# EAGLE design dengenn_top (EAGLE 9.6.2)
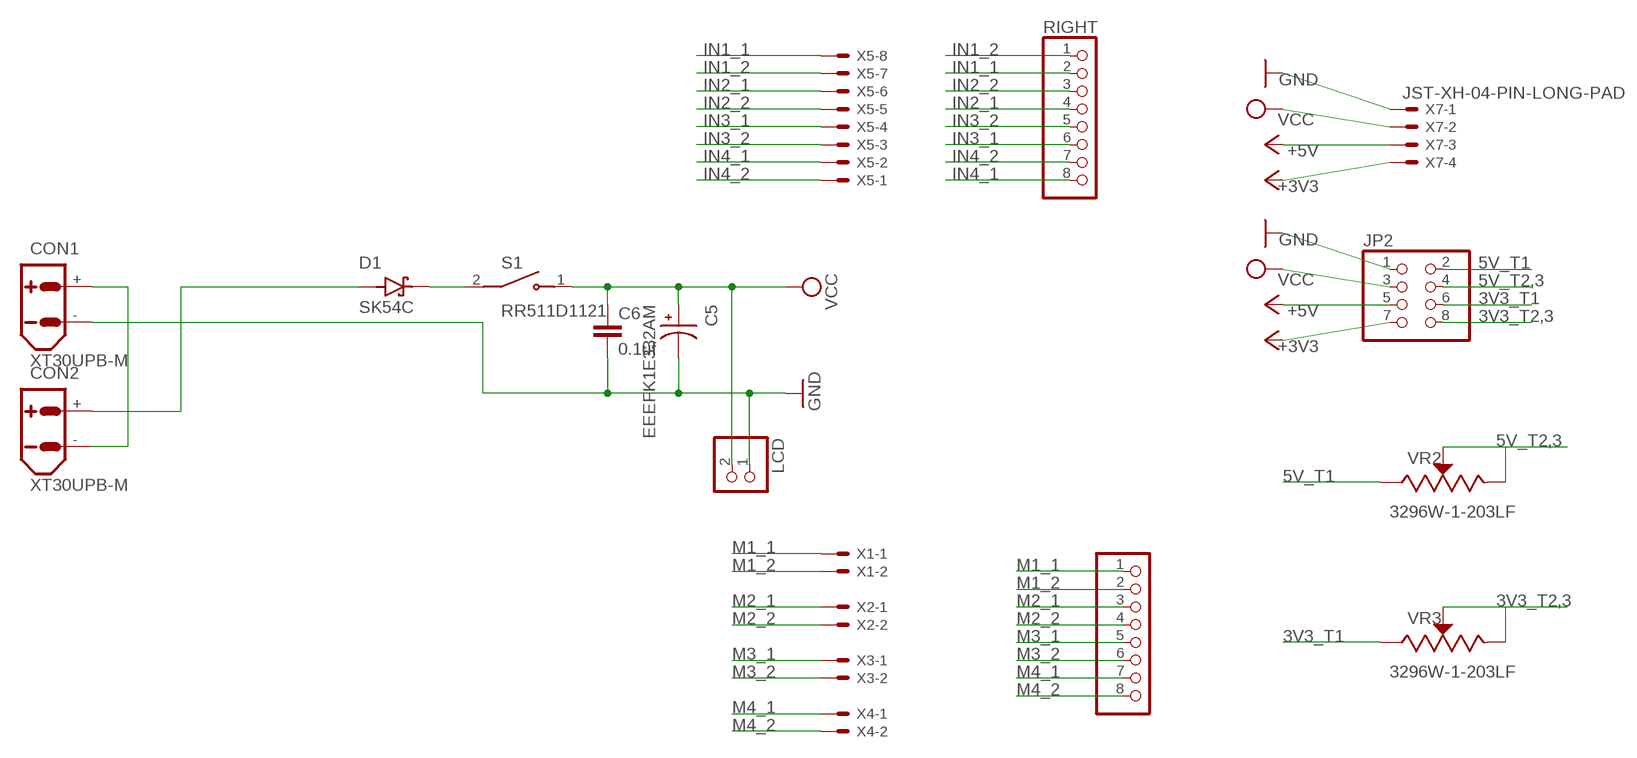
[diagram p0: schematic, sheet 1]

## Parts
C5  EEEFK1E332AM  [CAP_EEEFK1E332AM]
C6  0.1uf  C-EUC0603  [C0603]
CON1  XT30UPB-M  [XT30UPB-M]
CON2  XT30UPB-M  [XT30UPB-M]
D1  SK54C  [DIOM6859X262N]
JP2  PINHD-2X4  [2X04]
LCD  PINHD-1X2  [1X02]
LEFT  PINHD-1X8  [1X08]
RIGHT  PINHD-1X8  [1X08]
S1  RR511D1121  [E-SWITCH_RR511D1121]
VR2  3296W-1-203LF  [TRIM_3296W-1-203LF]
VR3  3296W-1-203LF  [TRIM_3296W-1-203LF]
X1  JST-XH-02-PIN-LONG-PAD  [JST-XH-02-PACKAGE-LONG-PAD]
X2  JST-XH-02-PIN-LONG-PAD  [JST-XH-02-PACKAGE-LONG-PAD]
X3  JST-XH-02-PIN-LONG-PAD  [JST-XH-02-PACKAGE-LONG-PAD]
X4  JST-XH-02-PIN-LONG-PAD  [JST-XH-02-PACKAGE-LONG-PAD]
X5  JST-XH-08-PIN-ROUND-PAD  [JST-XH-08-PACKAGE-ROUND-PAD]
X7  JST-XH-04-PIN-LONG-PAD  [JST-XH-04-PACKAGE-LONG-PAD]

## Nets
3V3_T1: JP2.6 VR3.1(CCW)
3V3_T2,3: JP2.8 VR3.2(WIPER) VR3.3(CW)
5V_T1: JP2.2 VR2.1(CCW)
5V_T2,3: JP2.4 VR2.2(WIPER) VR2.3(CW)
+3V3: JP2.7 X7.4
+5V: JP2.5 X7.3
GND: C5.2 C6.2 CON1.- JP2.1 LCD.1 X7.1
IN1_1: RIGHT.2 X5.8
IN1_2: RIGHT.1 X5.7
IN2_1: RIGHT.4 X5.6
IN2_2: RIGHT.3 X5.5
IN3_1: RIGHT.6 X5.4
IN3_2: RIGHT.5 X5.3
IN4_1: RIGHT.8 X5.2
IN4_2: RIGHT.7 X5.1
M1_1: LEFT.1 X1.1
M1_2: LEFT.2 X1.2
M2_1: LEFT.3 X2.1
M2_2: LEFT.4 X2.2
M3_1: LEFT.5 X3.1
M3_2: LEFT.6 X3.2
M4_1: LEFT.7 X4.1
M4_2: LEFT.8 X4.2
N$1: CON1.+ CON2.-
N$2: CON2.+ D1.A
N$12: D1.C(K) S1.2(COM)
VCC: C5.1 C6.1 JP2.3 LCD.2 S1.1(NO) X7.2

## Library data of the parts
C5 = EEEFK1E332AM:EEEFK1E332AM: Check availability <https://pricing.snapeda.com/parts/EEEFK1E332AM/Panasonic/view-part?ref=eda>; AVAILABILITY: In Stock; DESCRIPTION: 3300µF 25V Aluminum Electrolytic Capacitors Radial, Can - SMD 5000 Hrs @ 105°C; MF: Panasonic; MP: EEEFK1E332AM; PACKAGE: RADIAL-2 Panasonic; PRICE: None; PURCHASE-URL: https://pricing.snapeda.com/search/part/EEEFK1E332AM/?ref=eda
C6 = rcl:C-EU: CAPACITOR, European symbol; SPICEPREFIX: C
CON1 CON2 = amass:XT30: AMASS XT30 connector Store in Japan AMASS XT30 connector <https://szc.jp/ams-xt30>
D1 = SK54C:SK54C: Check availability <https://pricing.snapeda.com/parts/SK54C/Taiwan%20Semiconductor/view-part?ref=eda>; AVAILABILITY: In Stock; DESCRIPTION: 5A, 40V, Schottky Rectifier; MF: Taiwan Semiconductor; MP: SK54C; PACKAGE: SMC-2 Taiwan Semiconductor; PRICE: None; PURCHASE-URL: https://pricing.snapeda.com/search/part/SK54C/?ref=eda
JP2 = pinhead:PINHD-2X4: PIN HEADER
LCD = pinhead:PINHD-1X2: PIN HEADER
LEFT RIGHT = pinhead:PINHD-1X8: PIN HEADER
S1 = RR511D1121:RR511D1121: Check availability <https://pricing.snapeda.com/parts/RR511D1121/E-Switch/view-part?ref=eda>; AVAILABILITY: In Stock; DESCRIPTION: Rocker Switch, RR5 Series, SPST,OFF-ON,Blk Rocker,I/O Legend, 20A, 125VAC, QC; MF: E-Switch; MP: RR511D1121; PACKAGE: None; PRICE: None; PURCHASE-URL: https://pricing.snapeda.com/search/part/RR511D1121/?ref=eda
VR2 VR3 = 3296W-1-203LF:3296W-1-203LF: Res Cermet Trimmer 500K Ohm 10% 0.5W 25(Elec)Turn 2.19mm (9.53 X 4.83 X 11.55mm) Pin Thru-Hole Tube Check availability <https://pricing.snapeda.com/parts/3296W-1-203LF/Bourns/view-part?ref=eda>; AVAILABILITY: In Stock; DESCRIPTION: 20 kOhms 0.5W, 1/2W PC Pins Through Hole Trimmer Potentiometer Cermet 25.0 Turn Top Adjustment; MF: Bourns; MP: 3296W-1-203LF; PACKAGE: NON STANDARD-3 Bourns; PRICE: None; PURCHASE-URL: https://pricing.snapeda.com/search/part/3296W-1-203LF/?ref=eda
X1-X4 = JST XH Connectors v1-0:JST-XH-02-PIN: JST XH Connector 2 Pin Wire to board connector. Pitch: 2,54 mm, (0.100") Number of pins: 2 Created by Rembrandt Electronics www.rembrandtelectronics.com
X5 = Rembrandt Electronics - JST XH Connectors v1-0:JST-XH-08-PIN: JST XH Connector 2 Pin Wire to board connector. Pitch: 2,54 mm, (0.100") Number of pins: 8 Created by Rembrandt Electronics www.rembrandtelectronics.com
X7 = JST XH Connectors v1-0:JST-XH-04-PIN: JST XH Connector 2 Pin Wire to board connector. Pitch: 2,54 mm, (0.100") Number of pins: 4 Created by Rembrandt Electronics www.rembrandtelectronics.com

## Board
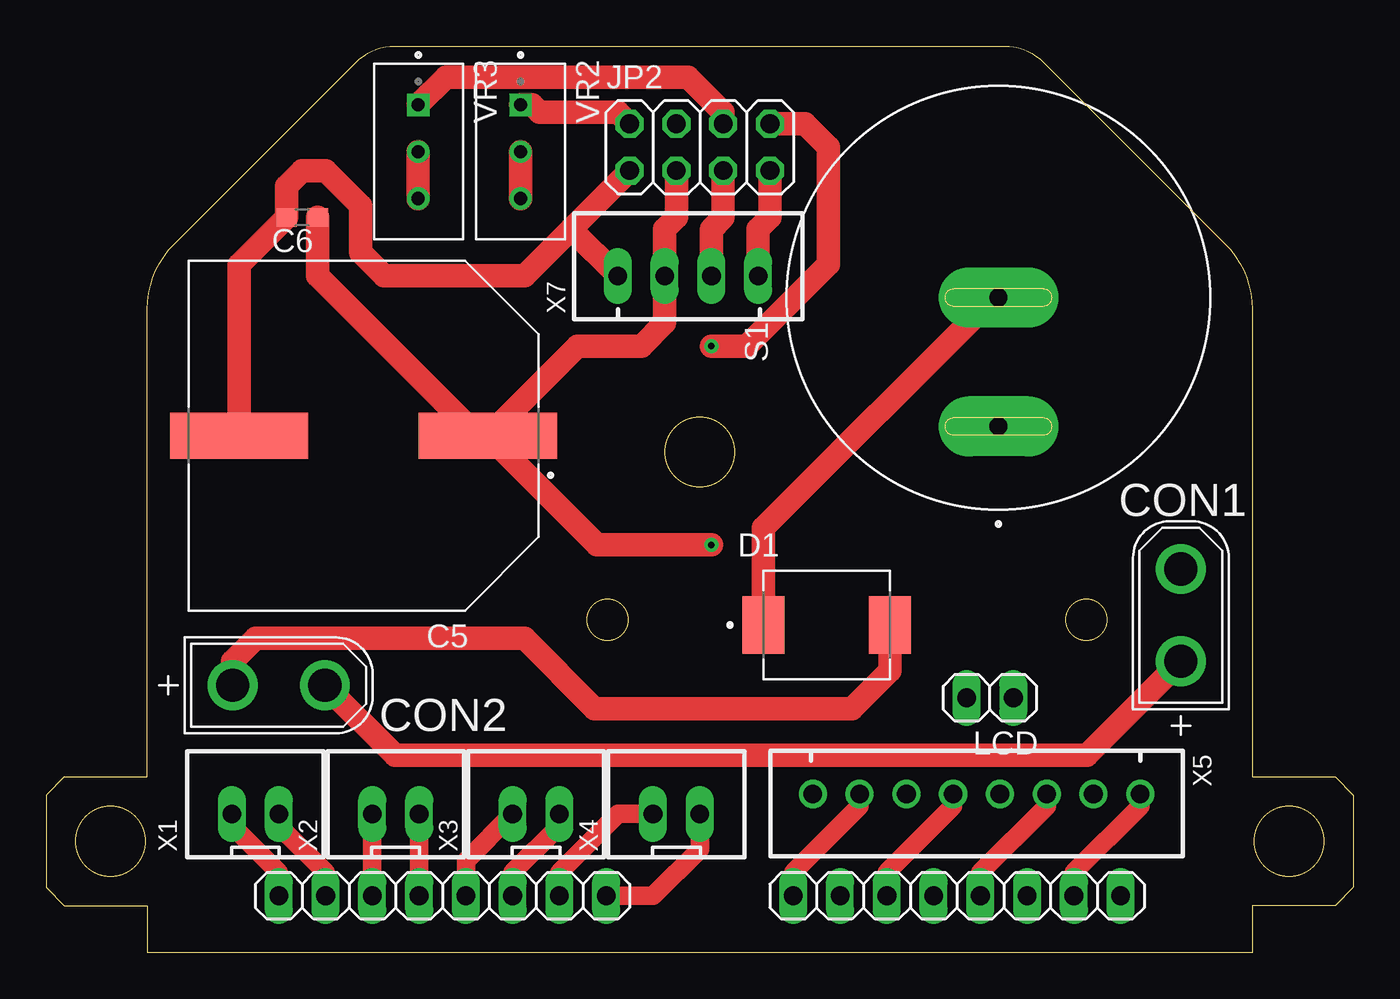
[diagram p1: board, top side]
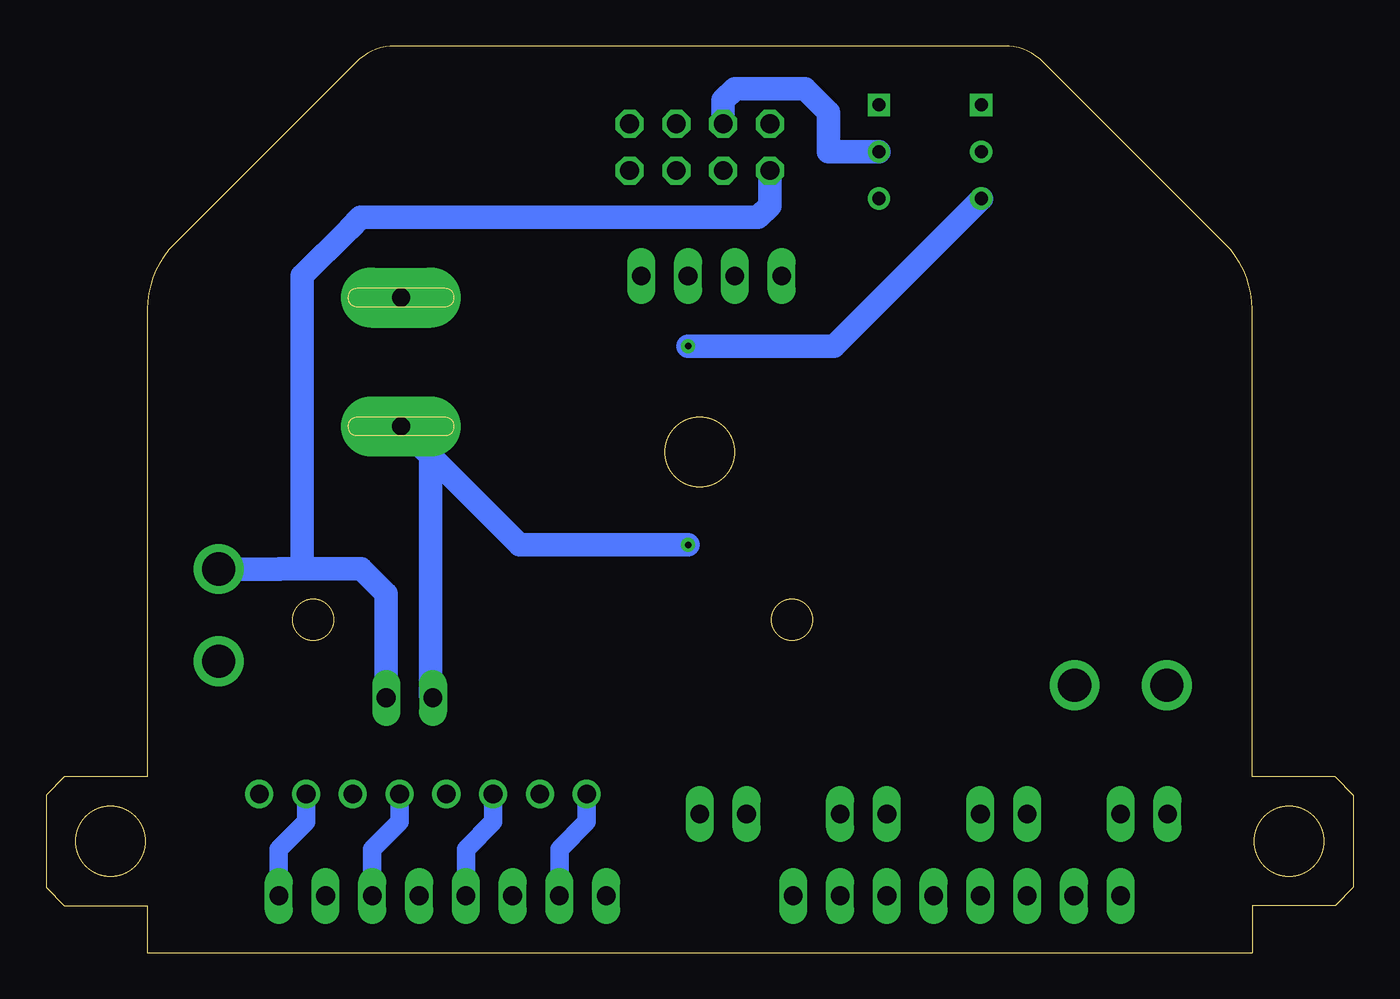
[diagram p2: board, bottom side, seen from below]

Size 71 x 49.21 mm. Coordinates in mm from the lower left corner, seen from the top.
Outline: 1,9.54 0,8.54 0,3.54 1,2.54 5.5,2.54 5.5,0 65.5,0 65.5,2.54 70,2.54 71,3.54 71,8.54 70,9.54 65.5,9.54 65.5,34.93 arc45 64.04,38.46 54.16,48.33 arc45 52.04,49.21 18.96,49.21 arc45 16.84,48.33 6.96,38.46 arc45 5.5,34.93 5.5,9.54 1,9.54
Outline: circle at 3.5,6.04 radius 1.9
Outline: circle at 67.5,6.04 radius 1.9
Outline: circle at 35.5,27.18 radius 1.9
Outline: circle at 30.5,18.06 radius 1.12
Outline: circle at 56.5,18.06 radius 1.12
Copper layers (1*16): Top 0.035mm / dielectric 1.5mm / Bottom 0.035mm
Design rules "default": minimum track width 6mil, minimum drill 0.35mm, track to track 6mil, track to pad 6mil, pad to pad 6mil, via to via 6mil, smd to smd 6mil, copper to edge 40mil, drill to drill 6mil, minimum pad ring 10mil, minimum via ring 8mil, stop-mask expansion 4mil, vias tented up to drill 0mil, thermal gap 10mil

### Footprints (pad centres in the part's own frame; a part is rotated, then mirrored left to right if it is on the bottom)
CAP_EEEFK1E332AM = smd 7.5 x 2.5: 1 -6.75,0; 2 6.75,0
C0603 = smd 1.1 x 1: 1 -0.85,0; 2 0.85,0
XT30UPB-M = drill 1.8: + 2.5,0; - -2.5,0
DIOM6859X262N = smd 2.29 x 3.12: A 3.43,0; C -3.43,0
2X04 = drill 1.016 octagon: 1 -3.81,-1.27; 2 -3.81,1.27; 3 -1.27,-1.27; 4 -1.27,1.27; 5 1.27,-1.27; 6 1.27,1.27; 7 3.81,-1.27; 8 3.81,1.27
1X02 = drill 1.016 long: 1 -1.27,0; 2 1.27,0
1X08 = drill 1.016 long: 1 -8.89,0; 2 -6.35,0; 3 -3.81,0; 4 -1.27,0; 5 1.27,0; 6 3.81,0; 7 6.35,0; 8 8.89,0
E-SWITCH_RR511D1121 = drill 0.98 pad 3.26 long: 1 -7,0; 2 0,0
TRIM_3296W-1-203LF = drill 0.71 square: 1 -2.54,0 | drill 0.71: 2 0,0; 3 2.54,0
JST-XH-02-PACKAGE-LONG-PAD = drill 1.016 long: 1 -1.27,0; 2 1.27,0
JST-XH-08-PACKAGE-ROUND-PAD = drill 1.016: 1 -8.89,0; 2 -6.35,0; 3 -3.81,0; 4 -1.27,0; 5 1.27,0; 6 3.81,0; 7 6.35,0; 8 8.89,0
JST-XH-04-PACKAGE-LONG-PAD = drill 1.016 long: 1 -3.81,0; 2 -1.27,0; 3 1.27,0; 4 3.81,0

### Placement (x,y rotation side)
C5  17.25,28.07 180 top
C6  13.91,39.91 180 top
CON1  61.63,18.32 270 top
CON2  12.64,14.51 180 top
D1  42.39,17.78 0 top
JP2  35.5,43.72 0 top
LCD  51.26,13.83 180 top
LEFT  21.53,3.08 0 top
RIGHT  49.47,3.08 0 top
S1  51.72,35.56 90 top
VR2  25.77,43.48 270 top
VR3  20.21,43.48 270 top
X1  11.37,7.53 0 top
X2  18.99,7.53 0 top
X3  26.61,7.53 0 top
X4  34.23,7.53 0 top
X5  50.53,8.61 180 top
X7  34.87,36.74 0 top

### Tracks (layer width: path | path; a pad name or v marks a point on that pad's centre or on a via)
3V3_T1
  Top 1.27: VR3.1 21.73,47.53 34.87,47.53 36.77,45.63 JP2.6
3V3_T2,3  (via drill 0.35)
  Top 1.27: VR3.2 VR3.3 | JP2.8 41.22,44.99 42.48,43.72 42.48,37.37 38.04,32.93 v36.13,32.93
  Bottom 1.27: VR3.3 28.23,32.93 v36.13,32.93
5V_T1
  Top 1.27: JP2.2 31.05,45.63 26.8,45.63 26.41,46.02 VR2.1
5V_T2,3
  Top 1.27: VR2.2 VR2.3
  Bottom 1.27: VR2.2 28.52,43.48 28.52,45.63 29.79,46.9 33.59,46.9 34.23,46.26 JP2.4
+3V3
  Top 1.27: JP2.7 39.31,39.91 38.67,39.28 X7.4
+5V
  Top 1.27: JP2.5 36.77,39.91 36.13,39.28 X7.3
GND
  Top 1.27: C5.2 10.5,37.35 C6.2 13.06,41.6 13.91,42.45 15.18,42.45 17.09,40.55 17.09,38.01 18.36,36.74 25.98,36.74 28.52,39.28 | 28.52,39.28 JP2.1 | 28.52,39.28 X7.1
  Bottom 1.27: LCD.1 52.53,19.48 53.89,20.83 57.09,20.83 | 57.09,20.83 58.3,20.83 58.31,20.82 CON1.- | 57.09,20.83 57.09,36.74 54.55,39.28 53.91,39.91 32.33,39.91 31.69,40.55 JP2.1
IN1_1
  Bottom 1.016: X5.8 41.64,7.1 43.12,5.62 RIGHT.2
IN1_2
  Top 1.016: RIGHT.1 40.58,4.35 44.18,7.95 X5.7
IN2_1
  Bottom 1.016: X5.6 46.72,7.1 48.2,5.62 RIGHT.4
IN2_2
  Top 1.016: X5.5 49.26,7.95 45.66,4.35 RIGHT.3
IN3_1
  Bottom 1.016: X5.4 51.8,7.1 53.28,5.62 RIGHT.6
IN3_2
  Top 1.016: X5.3 54.34,7.95 50.74,4.35 RIGHT.5
IN4_1
  Bottom 1.016: X5.2 56.88,7.1 58.36,5.62 RIGHT.8
IN4_2
  Top 1.016: X5.1 59.42,7.95 55.82,4.35 RIGHT.7
M1_1
  Top 1.016: LEFT.1 12.64,4.35 10.1,6.89 X1.1
M1_2
  Top 1.016: X1.2 12.64,6.89 15.18,4.35 LEFT.2
M2_1
  Top 1.016: X2.1 LEFT.3
M2_2
  Top 1.016: X2.2 LEFT.4
M3_1
  Top 1.016: X3.1 22.8,4.99 LEFT.5
M3_2
  Top 1.016: X3.2 27.88,6.89 25.34,4.35 LEFT.6
M4_1
  Top 1.016: LEFT.7 27.88,4.35 31.05,7.53 X4.1
M4_2
  Top 1.016: X4.2 35.5,5.62 32.96,3.08 LEFT.8
N$1
  Top 1.27: CON2.- 18.95,10.7 56.51,10.7 CON1.+
N$2
  Top 1.27: CON2.+ 10.14,15.82 11.37,17.05 25.98,17.05 29.79,13.24 43.76,13.24 45.82,15.31 D1.A
N$12
  Top 1.27: D1.C 38.96,23.05 51.47,35.56 S1.2
VCC  (via drill 0.35)
  Top 1.27: C6.1 14.76,36.74 23.43,28.07 C5.1 | v36.13,22.13 29.93,22.13 C5.1 | JP2.3 34.23,39.91 33.59,39.28 X7.2 33.59,34.2 32.33,32.93 28.86,32.93 C5.1
  Bottom 1.27: LCD.2 50.11,13.95 50.11,26.95 S1.1 45.29,22.13 v36.13,22.13